# Altium project PCB2.PrjPcb
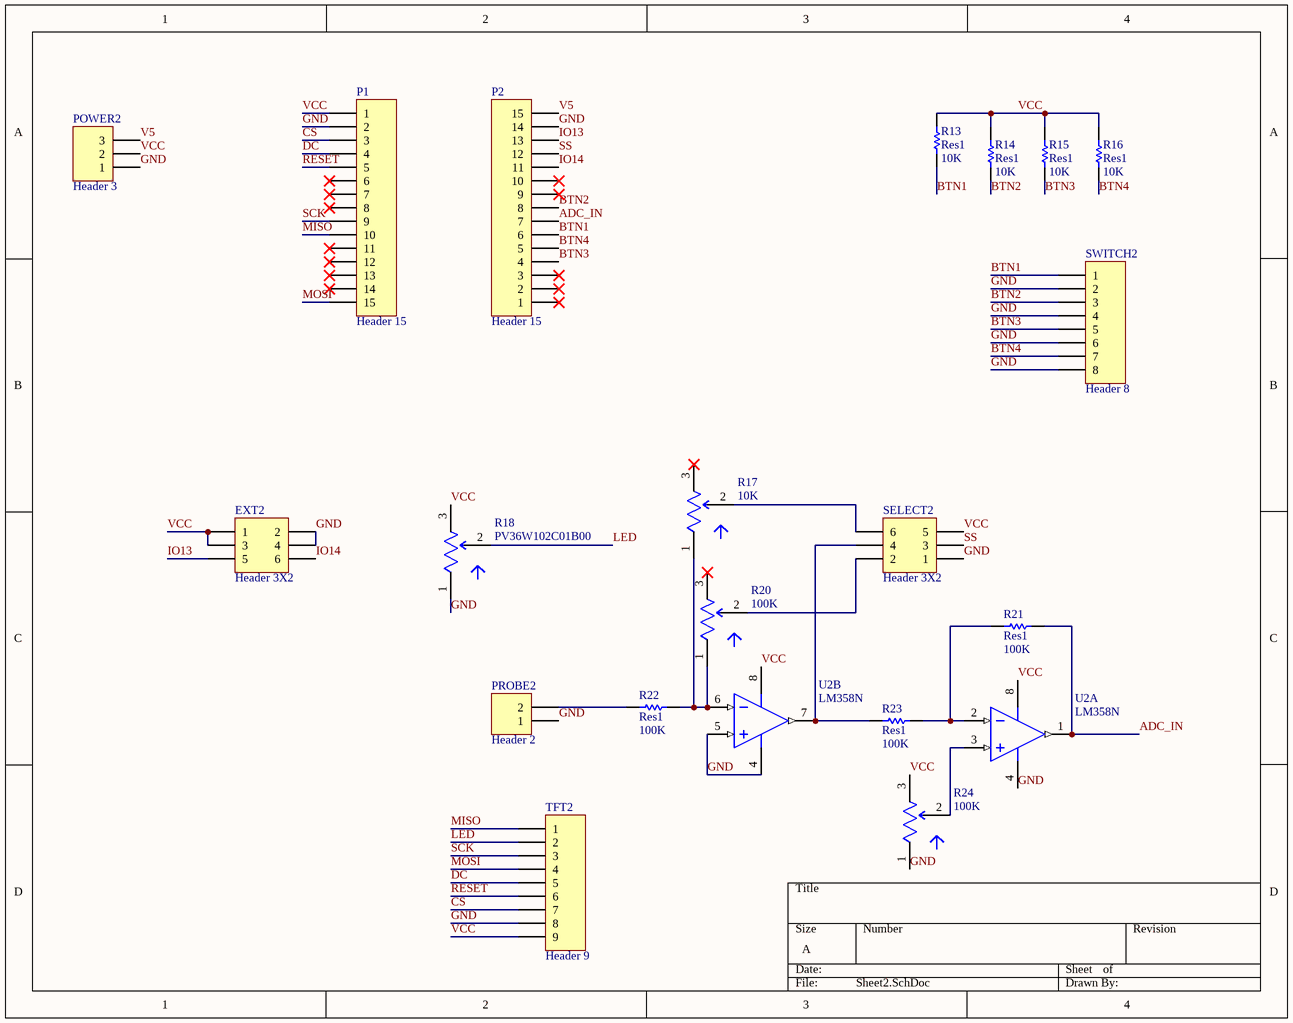
[diagram p0: Sheet2.SchDoc]
1 sheet, 20 parts. Net scope: global (net labels, ports and power ports of the same name join across sheets).
Board file: PCB2.PcbDoc

## Sheet Sheet2.SchDoc
size A; SheetNumber: 1; SheetTotal: 1

### Parts
EXT2  Header 3X2  [HDR2X3]
P1  Header 15  [HDR1X15]
P2  Header 15  [HDR1X15]
POWER2  Header 3  [HDR1X3]
PROBE2  Header 2  [HDR1X2]
R13  Res1  value 10K  [AXIAL-0.3]
R14  Res1  value 10K  [AXIAL-0.3]
R15  Res1  value 10K  [AXIAL-0.3]
R16  Res1  value 10K  [AXIAL-0.3]
R17  10K  [FP-PV36W-MFG]
R18  PV36W102C01B00  [FP-PV36W-MFG]
R20  100K  [FP-PV36W-MFG]
R21  Res1  value 100K  [AXIAL-0.3]
R22  Res1  value 100K  [AXIAL-0.3]
R23  Res1  value 100K  [AXIAL-0.3]
R24  100K  [FP-PV36W-MFG]
SELECT2  Header 3X2  [HDR2X3]
SWITCH2  Header 8  [HDR1X8]
TFT2  Header 9  [HDR1X9]
U2  LM358N  [ONSC-PDIP-8-626-05_M]  (parts A,B of 2)

### Nets
ADC_IN: P2.7 R21.1 U2.1(OUTA)
BTN1: P2.6 R13.1 SWITCH2.1
BTN2: P2.8 R14.1 SWITCH2.3
BTN3: P2.4 R15.1 SWITCH2.5
BTN4: P2.5 R16.1 SWITCH2.7
CS: P1.3 TFT2.7
DC: P1.4 TFT2.5
GND: EXT2.2 EXT2.4 P1.2 P2.14 POWER2.1 PROBE2.1 R18.1 R24.1 SELECT2.1 SWITCH2.2 SWITCH2.4 SWITCH2.6 SWITCH2.8 TFT2.8 U2.4(VEE/GND) U2.5(INB+)
IO13: EXT2.5 P2.13
IO14: EXT2.6 P2.11
LED: R18.2(Wiper) TFT2.2
MISO: P1.10 TFT2.1
MOSI: P1.15 TFT2.4
RESET: P1.5 TFT2.6
SCK: P1.9 TFT2.3
SS: P2.12 SELECT2.3
V5: P2.15 POWER2.3
VCC: EXT2.1 EXT2.3 P1.1 POWER2.2 R13.2 R14.2 R15.2 R16.2 R18.3 R24.3 SELECT2.5 TFT2.9 U2.8(VCC)
NetPROBE2_2: PROBE2.2 R22.2
NetR17_1: R17.1 R20.1 R22.1 U2.6(INB-)
NetR17_2: R17.2(Wiper) SELECT2.6
NetR20_2: R20.2(Wiper) SELECT2.2
NetR21_2: R21.2 R23.1 U2.2(INA-)
NetR23_2: R23.2 SELECT2.4 U2.7(OUTB)
NetR24_2: R24.2(Wiper) U2.3(INA+)

Not connected (* = marked no-connect by the designer): P1 6* 7* 8* 11* 12* 13* 14*; P2 1* 2* 3* 9* 10*; R17 3*; R20 3*

### Library data of the parts
EXT2 SELECT2 = Header 3X2: Header, 3-Pin, Dual row; LatestRevisionDate: 17-Jul-2002; LatestRevisionNote: Re-released for DXP Platform.; Publisher: Altium Limited
P1 P2 = Header 15: Header, 15-Pin; LatestRevisionDate: 17-Jul-2002; LatestRevisionNote: Re-released for DXP Platform.; Publisher: Altium Limited
POWER2 = Header 3: Header, 3-Pin; LatestRevisionDate: 17-Jul-2002; LatestRevisionNote: Re-released for DXP Platform.; Publisher: Altium Limited
PROBE2 = Header 2: Header, 2-Pin; LatestRevisionDate: 17-Jul-2002; LatestRevisionNote: Re-released for DXP Platform.; Publisher: Altium Limited
R13-R16 R21-R23 = Res1: Resistor; Published: 8-Jun-2000; LatestRevisionDate: 17-Jul-2002; LatestRevisionNote: Re-released for DXP Platform.; PackageReference: AXIAL-0.3; Publisher: Altium Limited; PackageDescription: Axial Device, Thru-Hole; 2 Leads; 0.3 in Pin Spacing
R17 R20 R24 = CMP-07234-000009-1: TRIMMER 1K OHM 0.5W PC PIN TOP; Manufacturer Part Number: PV36W102C01B00; Manufacturer: Bourns; Temperature Coefficient: 100ppm/°C; Standoff Height: 0.38mm; Resistance: 1kΩ; Tolerance: 10%; Value: 1kΩ; Octopart: https://octopart.com/pv36w102c01b00-bourns-71612321; ComponentLink2URL: https://www.bourns.com/docs/Product-Datasheets/pv36.pdf; Category: Res; RoHS: TRUE; Device Class L1: Passive Components; Height: 12.05mm; ComponentLink2Description: Datasheet; Mouser Description: Trimmer Resistors - Through Hole 1.0Kohms 10mm Square 25turn; Package: PV36W; Device Class L2: Resistors; Power Rating: 0.5W; Digikey Description: TRIMMER 1K OHM 0.5W PC PIN TOP; Automotive: No; Temperature Range High: +125°C; Series: PV36; Temperature Range Low: -55°C; Temperature: -55°C to +125°C; Device Class L3: Variable Resistors and Potentiometers; Composition: Cermet; Lead Free: Yes
R18 = CMP-07234-000009-1: TRIMMER 1K OHM 0.5W PC PIN TOP; Manufacturer: Bourns; Temperature Coefficient: 100ppm/°C; Standoff Height: 0.38mm; Resistance: 1kΩ; Tolerance: 10%; Value: 1kΩ; Octopart: https://octopart.com/pv36w102c01b00-bourns-71612321; ComponentLink2URL: https://www.bourns.com/docs/Product-Datasheets/pv36.pdf; Category: Res; Manufacturer Part Number: PV36W102C01B00; RoHS: TRUE; Device Class L1: Passive Components; Height: 12.05mm; ComponentLink2Description: Datasheet; Mouser Description: Trimmer Resistors - Through Hole 1.0Kohms 10mm Square 25turn; Package: PV36W; Device Class L2: Resistors; Power Rating: 0.5W; Digikey Description: TRIMMER 1K OHM 0.5W PC PIN TOP; Automotive: No; Temperature Range High: +125°C; Series: PV36; Temperature Range Low: -55°C; Temperature: -55°C to +125°C; Device Class L3: Variable Resistors and Potentiometers; Composition: Cermet; Lead Free: Yes
SWITCH2 = Header 8: Header, 8-Pin; LatestRevisionDate: 17-Jul-2002; LatestRevisionNote: Re-released for DXP Platform.; Publisher: Altium Limited
TFT2 = Header 9: Header, 9-Pin; LatestRevisionDate: 17-Jul-2002; LatestRevisionNote: Re-released for DXP Platform.; Publisher: Altium Limited
U2 = CMP-1310-00098-1: Single Supply Dual Operational Amplifier, 3 to 32 V, 0 to 70 degC, 8-Pin PDIP, Tube; Manufacturer: On Semiconductor; VCC Max (V): 32; VCC Min (V): 3; Mounting Technology: Through Hole; ComponentLink3Description: Package Specification; ComponentLink3URL: http://www.onsemi.com/pub_link/Collateral/LM211-D.PDF; RoHS: FALSE; Packing: Tube; PackageDescription: 8-Pin Plastic Dual-In Line Package, Body 9.52 x 6.605 mm, Pitch 2.54 mm; PackageReference: PDIP-8-626-05; PackageVersion: Rev. M, 04/2010; PartNumber: LM358N; ComponentLink2Description: Datasheet; ComponentLink2URL: http://www.onsemi.cn/pub_link/Collateral/LM358-D.PDF; ComponentLink1URL: http://www.onsemi.com/; ComponentLink1Description: Manufacturer URL; DatasheetVersion: Rev. 27